# Altium project WordClock_PrJ.PrjPCB
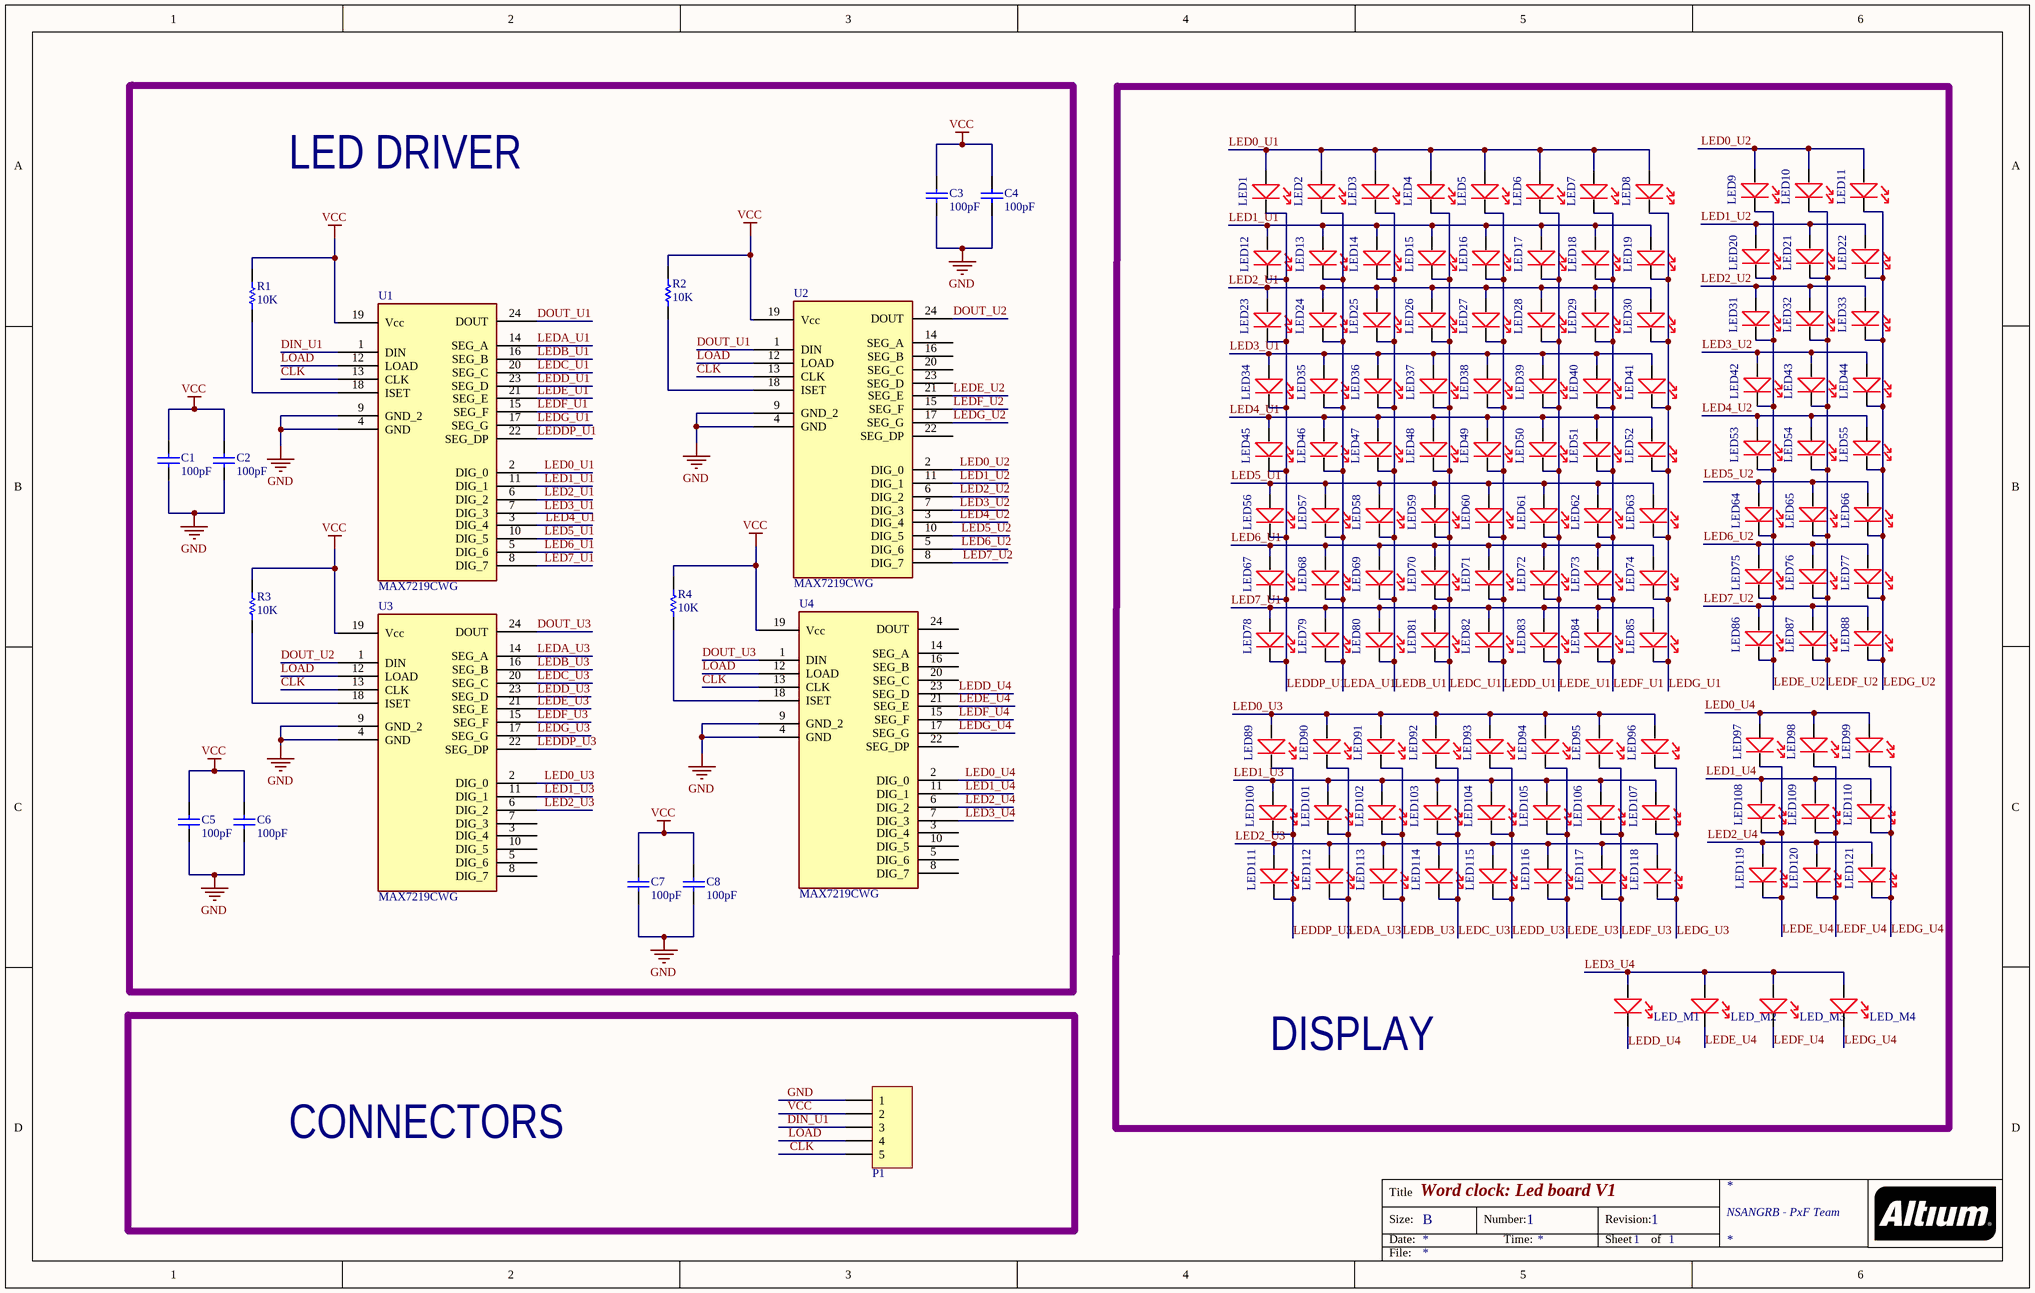
[diagram p0: Sche.SchDoc]
1 sheet, 142 parts. Net scope: global (net labels, ports and power ports of the same name join across sheets).
Board file: PCB.PcbDoc

## Sheet Sche.SchDoc: Word clock: Led board V1
size B; Address2: NSANGRB - PxF Team; DocumentNumber: 1; Revision: 1; SheetNumber: 1; SheetTotal: 1

### Parts
C1  value 100pF  [CAP-SM-0805]  (hidden comment: Cap Non-Pol SMD)
C2  value 100pF  [CAP-SM-0805]  (hidden comment: Cap Non-Pol SMD)
C3  value 100pF  [CAP-SM-0805]  (hidden comment: Cap Non-Pol SMD)
C4  value 100pF  [CAP-SM-0805]  (hidden comment: Cap Non-Pol SMD)
C5  value 100pF  [CAP-SM-0805]  (hidden comment: Cap Non-Pol SMD)
C6  value 100pF  [CAP-SM-0805]  (hidden comment: Cap Non-Pol SMD)
C7  value 100pF  [CAP-SM-0805]  (hidden comment: Cap Non-Pol SMD)
C8  value 100pF  [CAP-SM-0805]  (hidden comment: Cap Non-Pol SMD)
LED1  KA-3528EC  [DIOM3020X13N]  (value not drawn)
LED2  KA-3528EC  [DIOM3020X13N]  (value not drawn)
LED3  KA-3528EC  [DIOM3020X13N]  (value not drawn)
LED4  KA-3528EC  [DIOM3020X13N]  (value not drawn)
LED5  KA-3528EC  [DIOM3020X13N]  (value not drawn)
LED6  KA-3528EC  [DIOM3020X13N]  (value not drawn)
LED7  KA-3528EC  [DIOM3020X13N]  (value not drawn)
LED8  KA-3528EC  [DIOM3020X13N]  (value not drawn)
LED9  KA-3528EC  [DIOM3020X13N]  (value not drawn)
LED10  KA-3528EC  [DIOM3020X13N]  (value not drawn)
LED11  KA-3528EC  [DIOM3020X13N]  (value not drawn)
LED12  KA-3528EC  [DIOM3020X13N]  (value not drawn)
LED13  KA-3528EC  [DIOM3020X13N]  (value not drawn)
LED14  KA-3528EC  [DIOM3020X13N]  (value not drawn)
LED15  KA-3528EC  [DIOM3020X13N]  (value not drawn)
LED16  KA-3528EC  [DIOM3020X13N]  (value not drawn)
LED17  KA-3528EC  [DIOM3020X13N]  (value not drawn)
LED18  KA-3528EC  [DIOM3020X13N]  (value not drawn)
LED19  KA-3528EC  [DIOM3020X13N]  (value not drawn)
LED20  KA-3528EC  [DIOM3020X13N]  (value not drawn)
LED21  KA-3528EC  [DIOM3020X13N]  (value not drawn)
LED22  KA-3528EC  [DIOM3020X13N]  (value not drawn)
LED23  KA-3528EC  [DIOM3020X13N]  (value not drawn)
LED24  KA-3528EC  [DIOM3020X13N]  (value not drawn)
LED25  KA-3528EC  [DIOM3020X13N]  (value not drawn)
LED26  KA-3528EC  [DIOM3020X13N]  (value not drawn)
LED27  KA-3528EC  [DIOM3020X13N]  (value not drawn)
LED28  KA-3528EC  [DIOM3020X13N]  (value not drawn)
LED29  KA-3528EC  [DIOM3020X13N]  (value not drawn)
LED30  KA-3528EC  [DIOM3020X13N]  (value not drawn)
LED31  KA-3528EC  [DIOM3020X13N]  (value not drawn)
LED32  KA-3528EC  [DIOM3020X13N]  (value not drawn)
LED33  KA-3528EC  [DIOM3020X13N]  (value not drawn)
LED34  KA-3528EC  [DIOM3020X13N]  (value not drawn)
LED35  KA-3528EC  [DIOM3020X13N]  (value not drawn)
LED36  KA-3528EC  [DIOM3020X13N]  (value not drawn)
LED37  KA-3528EC  [DIOM3020X13N]  (value not drawn)
LED38  KA-3528EC  [DIOM3020X13N]  (value not drawn)
LED39  KA-3528EC  [DIOM3020X13N]  (value not drawn)
LED40  KA-3528EC  [DIOM3020X13N]  (value not drawn)
LED41  KA-3528EC  [DIOM3020X13N]  (value not drawn)
LED42  KA-3528EC  [DIOM3020X13N]  (value not drawn)
LED43  KA-3528EC  [DIOM3020X13N]  (value not drawn)
LED44  KA-3528EC  [DIOM3020X13N]  (value not drawn)
LED45  KA-3528EC  [DIOM3020X13N]  (value not drawn)
LED46  KA-3528EC  [DIOM3020X13N]  (value not drawn)
LED47  KA-3528EC  [DIOM3020X13N]  (value not drawn)
LED48  KA-3528EC  [DIOM3020X13N]  (value not drawn)
LED49  KA-3528EC  [DIOM3020X13N]  (value not drawn)
LED50  KA-3528EC  [DIOM3020X13N]  (value not drawn)
LED51  KA-3528EC  [DIOM3020X13N]  (value not drawn)
LED52  KA-3528EC  [DIOM3020X13N]  (value not drawn)
LED53  KA-3528EC  [DIOM3020X13N]  (value not drawn)
LED54  KA-3528EC  [DIOM3020X13N]  (value not drawn)
LED55  KA-3528EC  [DIOM3020X13N]  (value not drawn)
LED56  KA-3528EC  [DIOM3020X13N]  (value not drawn)
LED57  KA-3528EC  [DIOM3020X13N]  (value not drawn)
LED58  KA-3528EC  [DIOM3020X13N]  (value not drawn)
LED59  KA-3528EC  [DIOM3020X13N]  (value not drawn)
LED60  KA-3528EC  [DIOM3020X13N]  (value not drawn)
LED61  KA-3528EC  [DIOM3020X13N]  (value not drawn)
LED62  KA-3528EC  [DIOM3020X13N]  (value not drawn)
LED63  KA-3528EC  [DIOM3020X13N]  (value not drawn)
LED64  KA-3528EC  [DIOM3020X13N]  (value not drawn)
LED65  KA-3528EC  [DIOM3020X13N]  (value not drawn)
LED66  KA-3528EC  [DIOM3020X13N]  (value not drawn)
LED67  KA-3528EC  [DIOM3020X13N]  (value not drawn)
LED68  KA-3528EC  [DIOM3020X13N]  (value not drawn)
LED69  KA-3528EC  [DIOM3020X13N]  (value not drawn)
LED70  KA-3528EC  [DIOM3020X13N]  (value not drawn)
LED71  KA-3528EC  [DIOM3020X13N]  (value not drawn)
LED72  KA-3528EC  [DIOM3020X13N]  (value not drawn)
LED73  KA-3528EC  [DIOM3020X13N]  (value not drawn)
LED74  KA-3528EC  [DIOM3020X13N]  (value not drawn)
LED75  KA-3528EC  [DIOM3020X13N]  (value not drawn)
LED76  KA-3528EC  [DIOM3020X13N]  (value not drawn)
LED77  KA-3528EC  [DIOM3020X13N]  (value not drawn)
LED78  KA-3528EC  [DIOM3020X13N]  (value not drawn)
LED79  KA-3528EC  [DIOM3020X13N]  (value not drawn)
LED80  KA-3528EC  [DIOM3020X13N]  (value not drawn)
LED81  KA-3528EC  [DIOM3020X13N]  (value not drawn)
LED82  KA-3528EC  [DIOM3020X13N]  (value not drawn)
LED83  KA-3528EC  [DIOM3020X13N]  (value not drawn)
LED84  KA-3528EC  [DIOM3020X13N]  (value not drawn)
LED85  KA-3528EC  [DIOM3020X13N]  (value not drawn)
LED86  KA-3528EC  [DIOM3020X13N]  (value not drawn)
LED87  KA-3528EC  [DIOM3020X13N]  (value not drawn)
LED88  KA-3528EC  [DIOM3020X13N]  (value not drawn)
LED89  KA-3528EC  [DIOM3020X13N]  (value not drawn)
LED90  KA-3528EC  [DIOM3020X13N]  (value not drawn)
LED91  KA-3528EC  [DIOM3020X13N]  (value not drawn)
LED92  KA-3528EC  [DIOM3020X13N]  (value not drawn)
LED93  KA-3528EC  [DIOM3020X13N]  (value not drawn)
LED94  KA-3528EC  [DIOM3020X13N]  (value not drawn)
LED95  KA-3528EC  [DIOM3020X13N]  (value not drawn)
LED96  KA-3528EC  [DIOM3020X13N]  (value not drawn)
LED97  KA-3528EC  [DIOM3020X13N]  (value not drawn)
LED98  KA-3528EC  [DIOM3020X13N]  (value not drawn)
LED99  KA-3528EC  [DIOM3020X13N]  (value not drawn)
LED100  KA-3528EC  [DIOM3020X13N]  (value not drawn)
LED101  KA-3528EC  [DIOM3020X13N]  (value not drawn)
LED102  KA-3528EC  [DIOM3020X13N]  (value not drawn)
LED103  KA-3528EC  [DIOM3020X13N]  (value not drawn)
LED104  KA-3528EC  [DIOM3020X13N]  (value not drawn)
LED105  KA-3528EC  [DIOM3020X13N]  (value not drawn)
LED106  KA-3528EC  [DIOM3020X13N]  (value not drawn)
LED107  KA-3528EC  [DIOM3020X13N]  (value not drawn)
LED108  KA-3528EC  [DIOM3020X13N]  (value not drawn)
LED109  KA-3528EC  [DIOM3020X13N]  (value not drawn)
LED110  KA-3528EC  [DIOM3020X13N]  (value not drawn)
LED111  KA-3528EC  [DIOM3020X13N]  (value not drawn)
LED112  KA-3528EC  [DIOM3020X13N]  (value not drawn)
LED113  KA-3528EC  [DIOM3020X13N]  (value not drawn)
LED114  KA-3528EC  [DIOM3020X13N]  (value not drawn)
LED115  KA-3528EC  [DIOM3020X13N]  (value not drawn)
LED116  KA-3528EC  [DIOM3020X13N]  (value not drawn)
LED117  KA-3528EC  [DIOM3020X13N]  (value not drawn)
LED118  KA-3528EC  [DIOM3020X13N]  (value not drawn)
LED119  KA-3528EC  [DIOM3020X13N]  (value not drawn)
LED120  KA-3528EC  [DIOM3020X13N]  (value not drawn)
LED121  KA-3528EC  [DIOM3020X13N]  (value not drawn)
LED_M1  KA-3528EC  [DIOM3020X13N]  (value not drawn)
LED_M2  KA-3528EC  [DIOM3020X13N]  (value not drawn)
LED_M3  KA-3528EC  [DIOM3020X13N]  (value not drawn)
LED_M4  KA-3528EC  [DIOM3020X13N]  (value not drawn)
P1  Header 5  [JP5]  (value not drawn)
R1  value 10K  [RES-SM-0805]  (hidden comment: RESISTOR SMD)
R2  value 10K  [RES-SM-0805]  (hidden comment: RESISTOR SMD)
R3  value 10K  [RES-SM-0805]  (hidden comment: RESISTOR SMD)
R4  value 10K  [RES-SM-0805]  (hidden comment: RESISTOR SMD)
U1  MAX7219CWG  [SOIC127P1030X265-24N]
U2  MAX7219CWG  [SOIC127P1030X265-24N]
U3  MAX7219CWG  [SOIC127P1030X265-24N]
U4  MAX7219CWG  [SOIC127P1030X265-24N]

### Blocks framed on the sheet
LED DRIVER: C1-C8 R1-R4 U1-U4
DISPLAY: LED1-LED121 LED_M1-LED_M4
CONNECTORS: P1

### Nets
GND: C1.1 C2.1 C3.1 C4.1 C5.1 C6.1 C7.1 C8.1 P1.1 U1.4(GND) U1.9(GND_2) U2.4(GND) U2.9(GND_2) U3.4(GND) U3.9(GND_2) U4.4(GND) U4.9(GND_2)
VCC: C1.2 C2.2 C3.2 C4.2 C5.2 C6.2 C7.2 C8.2 P1.2 R1.2 R2.2 R3.2 R4.2 U1.19(Vcc) U2.19(Vcc) U3.19(Vcc) U4.19(Vcc)
CLK: P1.5 U1.13(CLK) U2.13(CLK) U3.13(CLK) U4.13(CLK)
DIN_U1: P1.3 U1.1(DIN)
DOUT_U1: U1.24(DOUT) U2.1(DIN)
DOUT_U2: U2.24(DOUT) U3.1(DIN)
DOUT_U3: U3.24(DOUT) U4.1(DIN)
LED0_U1: LED1.1 LED2.1 LED3.1 LED4.1 LED5.1 LED6.1 LED7.1 LED8.1 U1.2(DIG_0)
LED0_U2: LED9.1 LED10.1 LED11.1 U2.2(DIG_0)
LED0_U3: LED89.1 LED90.1 LED91.1 LED92.1 LED93.1 LED94.1 LED95.1 LED96.1 U3.2(DIG_0)
LED0_U4: LED97.1 LED98.1 LED99.1 U4.2(DIG_0)
LED1_U1: LED12.1 LED13.1 LED14.1 LED15.1 LED16.1 LED17.1 LED18.1 LED19.1 U1.11(DIG_1)
LED1_U2: LED20.1 LED21.1 LED22.1 U2.11(DIG_1)
LED1_U3: LED100.1 LED101.1 LED102.1 LED103.1 LED104.1 LED105.1 LED106.1 LED107.1 U3.11(DIG_1)
LED1_U4: LED108.1 LED109.1 LED110.1 U4.11(DIG_1)
LED2_U1: LED23.1 LED24.1 LED25.1 LED26.1 LED27.1 LED28.1 LED29.1 LED30.1 U1.6(DIG_2)
LED2_U2: LED31.1 LED32.1 LED33.1 U2.6(DIG_2)
LED2_U3: LED111.1 LED112.1 LED113.1 LED114.1 LED115.1 LED116.1 LED117.1 LED118.1 U3.6(DIG_2)
LED2_U4: LED119.1 LED120.1 LED121.1 U4.6(DIG_2)
LED3_U1: LED34.1 LED35.1 LED36.1 LED37.1 LED38.1 LED39.1 LED40.1 LED41.1 U1.7(DIG_3)
LED3_U2: LED42.1 LED43.1 LED44.1 U2.7(DIG_3)
LED3_U4: LED_M1.1 LED_M2.1 LED_M3.1 LED_M4.1 U4.7(DIG_3)
LED4_U1: LED45.1 LED46.1 LED47.1 LED48.1 LED49.1 LED50.1 LED51.1 LED52.1 U1.3(DIG_4)
LED4_U2: LED53.1 LED54.1 LED55.1 U2.3(DIG_4)
LED5_U1: LED56.1 LED57.1 LED58.1 LED59.1 LED60.1 LED61.1 LED62.1 LED63.1 U1.10(DIG_5)
LED5_U2: LED64.1 LED65.1 LED66.1 U2.10(DIG_5)
LED6_U1: LED67.1 LED68.1 LED69.1 LED70.1 LED71.1 LED72.1 LED73.1 LED74.1 U1.5(DIG_6)
LED6_U2: LED75.1 LED76.1 LED77.1 U2.5(DIG_6)
LED7_U1: LED78.1 LED79.1 LED80.1 LED81.1 LED82.1 LED83.1 LED84.1 LED85.1 U1.8(DIG_7)
LED7_U2: LED86.1 LED87.1 LED88.1 U2.8(DIG_7)
LEDA_U1: LED2.2 LED13.2 LED24.2 LED35.2 LED46.2 LED57.2 LED68.2 LED79.2 U1.14(SEG_A)
LEDA_U3: LED90.2 LED101.2 LED112.2 U3.14(SEG_A)
LEDB_U1: LED3.2 LED14.2 LED25.2 LED36.2 LED47.2 LED58.2 LED69.2 LED80.2 U1.16(SEG_B)
LEDB_U3: LED91.2 LED102.2 LED113.2 U3.16(SEG_B)
LEDC_U1: LED4.2 LED15.2 LED26.2 LED37.2 LED48.2 LED59.2 LED70.2 LED81.2 U1.20(SEG_C)
LEDC_U3: LED92.2 LED103.2 LED114.2 U3.20(SEG_C)
LEDD_U1: LED5.2 LED16.2 LED27.2 LED38.2 LED49.2 LED60.2 LED71.2 LED82.2 U1.23(SEG_D)
LEDD_U3: LED93.2 LED104.2 LED115.2 U3.23(SEG_D)
LEDD_U4: LED_M1.2 U4.23(SEG_D)
LEDDP_U1: LED1.2 LED12.2 LED23.2 LED34.2 LED45.2 LED56.2 LED67.2 LED78.2 U1.22(SEG_DP)
LEDDP_U3: LED89.2 LED100.2 LED111.2 U3.22(SEG_DP)
LEDE_U1: LED6.2 LED17.2 LED28.2 LED39.2 LED50.2 LED61.2 LED72.2 LED83.2 U1.21(SEG_E)
LEDE_U2: LED9.2 LED20.2 LED31.2 LED42.2 LED53.2 LED64.2 LED75.2 LED86.2 U2.21(SEG_E)
LEDE_U3: LED94.2 LED105.2 LED116.2 U3.21(SEG_E)
LEDE_U4: LED97.2 LED108.2 LED119.2 LED_M2.2 U4.21(SEG_E)
LEDF_U1: LED7.2 LED18.2 LED29.2 LED40.2 LED51.2 LED62.2 LED73.2 LED84.2 U1.15(SEG_F)
LEDF_U2: LED10.2 LED21.2 LED32.2 LED43.2 LED54.2 LED65.2 LED76.2 LED87.2 U2.15(SEG_F)
LEDF_U3: LED95.2 LED106.2 LED117.2 U3.15(SEG_F)
LEDF_U4: LED98.2 LED109.2 LED120.2 LED_M3.2 U4.15(SEG_F)
LEDG_U1: LED8.2 LED19.2 LED30.2 LED41.2 LED52.2 LED63.2 LED74.2 LED85.2 U1.17(SEG_G)
LEDG_U2: LED11.2 LED22.2 LED33.2 LED44.2 LED55.2 LED66.2 LED77.2 LED88.2 U2.17(SEG_G)
LEDG_U3: LED96.2 LED107.2 LED118.2 U3.17(SEG_G)
LEDG_U4: LED99.2 LED110.2 LED121.2 LED_M4.2 U4.17(SEG_G)
LOAD: P1.4 U1.12(LOAD) U2.12(LOAD) U3.12(LOAD) U4.12(LOAD)
NetR1_1: R1.1 U1.18(ISET)
NetR2_1: R2.1 U2.18(ISET)
NetR3_1: R3.1 U3.18(ISET)
NetR4_1: R4.1 U4.18(ISET)

Not connected (* = marked no-connect by the designer): U2 14(SEG_A) 16(SEG_B) 20(SEG_C) 22(SEG_DP) 23(SEG_D); U3 3(DIG_4) 5(DIG_6) 7(DIG_3) 8(DIG_7) 10(DIG_5); U4 3(DIG_4) 5(DIG_6) 8(DIG_7) 10(DIG_5) 14(SEG_A) 16(SEG_B) 20(SEG_C) 22(SEG_DP) 24(DOUT)

### Notes on the sheet
- Title
- Size:
- Date:
- B
- Number:
- Time:
- Revision:
- Sheet
- of
- File:

### Library data of the parts
C1-C8 = Cap Non-Pol SMD: Capacitor
LED1-LED121 = LED_3528: KINGBRIGHT         KA-3528EC             LED, Red, SMD, 2.4mm, 20 mA, 2 V, 627 nm; Rad Hard: No; Type: Uni-Color; Number of LEDs: 1; Intensity: 40(Max) mcd; Peak Wavelength: 625 nm; Lens Appearance: Colorless Non Diffused; Lens Shape Type: Circular; Viewing Angle: 120 °; Mounting Orientation: Top Mount; Supplier 1: Farnell; Manufacturer: Kingbright; Manufacturer Part Number: KA-3528EC; Stock 1: 2196; Pricing 1: 5=0.372, 25=0.282, 100=0.232, 250=0.175, 500=0.15, 1000=0.134 (EUR); Package: 2SMD; Pin Count: 2; Color: Red; Mounting: Surface Mount; Category: LEDs; ComponentLink1URL: https://datasheet.ciiva.com/5785/1500240-5785780.pdf; ComponentLink1Description: https://datasheet.ciiva.com/5785/1500240-5785780.pdf; ComponentLink2URL: https://datasheet.ciiva.com/14176/bd254568-254571-14176482.pdf; ComponentLink2Description: https://datasheet.ciiva.com/14176/bd254568-254571-14176482.pdf; ComponentLink3URL: https://datasheet.ciiva.com/8060/1500240-8060332.pdf; ComponentLink3Description: https://datasheet.ciiva.com/8060/1500240-8060332.pdf; ComponentLink4URL: https://datasheet.ciiva.com/8060/1500240-8060331.pdf; ComponentLink4Description: https://datasheet.ciiva.com/8060/1500240-8060331.pdf; ComponentLink5URL: https://datasheet.ciiva.com/20166/72-8261-20166551.pdf; ComponentLink5Description: https://datasheet.ciiva.com/20166/72-8261-20166551.pdf; Supplier Part Number 1: 8530211
LED_M1-LED_M4 = LED_3528: KINGBRIGHT         KA-3528EC             LED, Red, SMD, 2.4mm, 20 mA, 2 V, 627 nm; Rad Hard: No; Number of LEDs: 1; Intensity: 40(Max) mcd; Peak Wavelength: 625 nm; Lens Appearance: Colorless Non Diffused; Lens Shape Type: Circular; Viewing Angle: 120 °; Mounting Orientation: Top Mount; Supplier 1: Farnell; Manufacturer: Kingbright; Manufacturer Part Number: KA-3528EC; Stock 1: 2196; Pricing 1: 5=0.372, 25=0.282, 100=0.232, 250=0.175, 500=0.15, 1000=0.134 (EUR); Package: 2SMD; Pin Count: 2; Type: Uni-Color; Color: Red; Mounting: Surface Mount; Category: LEDs; ComponentLink1URL: https://datasheet.ciiva.com/5785/1500240-5785780.pdf; ComponentLink1Description: https://datasheet.ciiva.com/5785/1500240-5785780.pdf; ComponentLink2URL: https://datasheet.ciiva.com/14176/bd254568-254571-14176482.pdf; ComponentLink2Description: https://datasheet.ciiva.com/14176/bd254568-254571-14176482.pdf; ComponentLink3URL: https://datasheet.ciiva.com/8060/1500240-8060332.pdf; ComponentLink3Description: https://datasheet.ciiva.com/8060/1500240-8060332.pdf; ComponentLink4URL: https://datasheet.ciiva.com/8060/1500240-8060331.pdf; ComponentLink4Description: https://datasheet.ciiva.com/8060/1500240-8060331.pdf; ComponentLink5URL: https://datasheet.ciiva.com/20166/72-8261-20166551.pdf; ComponentLink5Description: https://datasheet.ciiva.com/20166/72-8261-20166551.pdf; Supplier Part Number 1: 8530211
P1 = Header 5: Header, 5-Pin; LatestRevisionDate: 17-Jul-2002; LatestRevisionNote: Re-released for DXP Platform.; Publisher: Altium Limited
R1-R4 = RESISTOR SMD: Resistor
U1-U4 = MAX7219CWG: IC DRIVER LED DISP 8DGT 24-SOIC; Manufacturer: Maxim; Number of Digits: 8; Number of Segments: 64; Operating Supply Voltage: 4 V to 5.5 V; Supply Current - Max: 330 mA; Brand: Maxim Integrated; High Level Output Current: - 2 mA; Low Level Output Current: 5 mA; Pd - Power Dissipation: 941 mW; Unit Weight: 0.025909 oz; Supplier 1: Digi-Key; Manufacturer Part Number: MAX7219CWG; Stock 1: 0; Product Category: LED Display Drivers; Mounting Style: SMD/SMT; Package / Case: SOIC-Wide-24; Maximum Operating Temperature: + 70 C; Minimum Operating Temperature: 0 C; Packaging: Tube; Height: 2.35 mm; Length: 15.6 mm; Product: LED Display Drivers; Series: MAX7219; Factory Pack Quantity: 30; Width: 7.6 mm; Part # Aliases: MAX7219; &lt;PCN&gt;: http://www.mouser.com/PCN/Maxim IC_M000753.pdf; ComponentLink1URL: https://datasheet.ciiva.com/26876/max7219cwg-26876054.pdf; ComponentLink1Description: https://datasheet.ciiva.com/26876/max7219cwg-26876054.pdf; ComponentLink2URL: https://datasheet.ciiva.com/3166/max7219-max7221-3166235.pdf; ComponentLink2Description: https://datasheet.ciiva.com/3166/max7219-max7221-3166235.pdf; ComponentLink3URL: https://datasheet.ciiva.com/1941/max7219-max7221-1941392.pdf; ComponentLink3Description: https://datasheet.ciiva.com/1941/max7219-max7221-1941392.pdf; ComponentLink4URL: https://datasheet.ciiva.com/17405/max7219-max7221-17405253.pdf; ComponentLink4Description: https://datasheet.ciiva.com/17405/max7219-max7221-17405253.pdf; Supplier Part Number 1: MAX7219CWG-ND